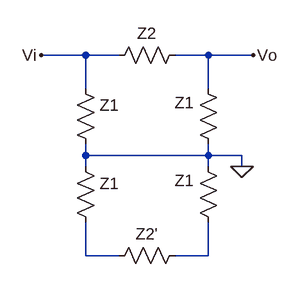
[diagram p0: schematic ej1kenelly.asc]
ej1kenelly.asc, the LTspice schematic file:
Version 4
SHEET 1 880 680
WIRE 128 80 64 80
WIRE 176 80 128 80
WIRE 304 80 256 80
WIRE 368 80 304 80
WIRE 128 128 128 80
WIRE 304 128 304 80
WIRE 128 224 128 208
WIRE 304 224 304 208
WIRE 304 224 128 224
WIRE 352 224 304 224
WIRE 128 240 128 224
WIRE 304 240 304 224
WIRE 352 240 352 224
WIRE 128 368 128 320
WIRE 176 368 128 368
WIRE 304 368 304 320
WIRE 304 368 256 368
FLAG 64 80 Vi
FLAG 368 80 Vo
FLAG 352 240 0
SYMBOL res 272 64 R90
WINDOW 0 0 56 VBottom 2
WINDOW 3 32 56 VTop 2
SYMATTR InstName Z2
SYMATTR Value ""
SYMBOL res 320 224 R180
WINDOW 0 36 76 Left 2
WINDOW 3 36 40 Left 2
SYMATTR InstName Z1
SYMATTR Value ""
SYMBOL res 320 336 R180
WINDOW 0 36 76 Left 2
WINDOW 3 36 40 Left 2
SYMATTR InstName Z1
SYMATTR Value ""
SYMBOL res 112 224 R0
SYMATTR InstName Z1
SYMATTR Value ""
SYMBOL res 112 112 R0
SYMATTR InstName Z1
SYMATTR Value ""
SYMBOL res 272 352 R90
WINDOW 0 0 56 VBottom 2
WINDOW 3 32 56 VTop 2
SYMATTR InstName Z2'
SYMATTR Value ""

The netlist it stands for:
* ej1kenelly.asc
R§Z2 Vo Vi
R§Z1 0 Vo
R§Z1 N002 0
R§Z1 0 N001
R§Z1 Vi 0
R§Z2' N002 N001
.backanno
.end